# EAGLE design main (EAGLE 6.1)
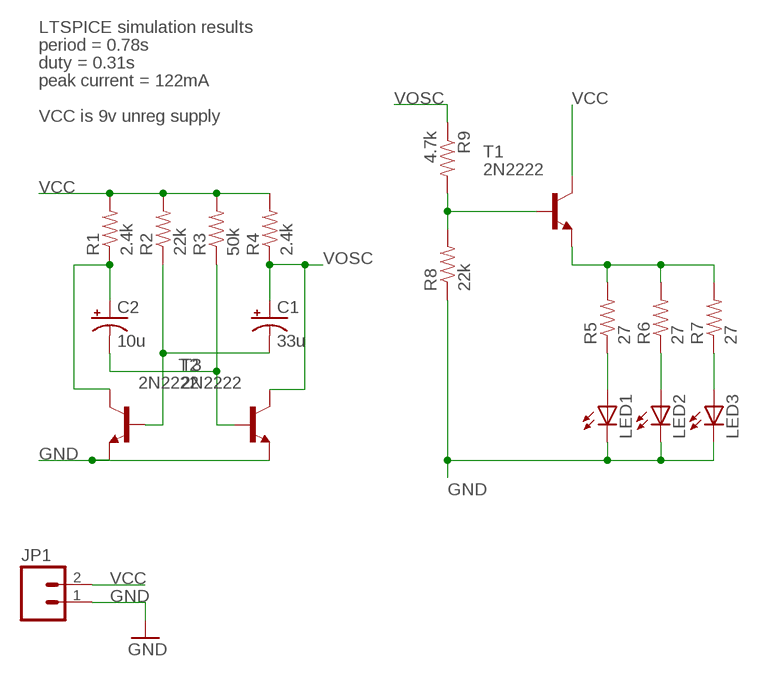
[diagram p0: schematic, sheet 1]

## Parts
C1  33u  CAP_POLPTH1  [CPOL-RADIAL-100UF-25V]
C2  10u  CAP_POLPTH1  [CPOL-RADIAL-100UF-25V]
JP1  M02LOCK  [1X02_LOCK]
LED1  LED5MM  [LED5MM]
LED2  LED5MM  [LED5MM]
LED3  LED5MM  [LED5MM]
R1  2.4k  RESISTORPTH-1/4W  [AXIAL-0.4]
R2  22k  RESISTORPTH-1/4W  [AXIAL-0.4]
R3  50k  RESISTORPTH-1/4W  [AXIAL-0.4]
R4  2.4k  RESISTORPTH-1/4W  [AXIAL-0.4]
R5  27  RESISTORPTH-1/4W  [AXIAL-0.4]
R6  27  RESISTORPTH-1/4W  [AXIAL-0.4]
R7  27  RESISTORPTH-1/4W  [AXIAL-0.4]
R8  22k  RESISTORPTH-1/4W  [AXIAL-0.4]
R9  4.7k  RESISTORPTH-1/4W  [AXIAL-0.4]
T1  2N2222  [TO18]
T2  2N2222  [TO18]
T3  2N2222  [TO18]

## Nets
GND: JP1.1 LED1.K(C) LED2.K(C) LED3.K(C) R8.P$1 T2.1(E) T3.1(E)
N$1: R5.P$2 R6.P$2 R7.P$2 T1.1(E)
N$2: C1.2(-) R2.P$1 T2.2(B)
N$3: C2.2(-) R3.P$1 T3.2(B)
N$4: C2.1(+) R1.P$1 T2.3(C)
N$5: LED1.A R5.P$1
N$6: LED2.A R6.P$1
N$7: LED3.A R7.P$1
N$42: R8.P$2 R9.P$2 T1.2(B)
VCC: JP1.2 R1.P$2 R2.P$2 R3.P$2 R4.P$2 T1.3(C)
VOSC: C1.1(+) R4.P$1 R9.P$1 T3.3(C)

## Notes on the sheet
- LTSPICE simulation results
- period = 0.78s
- duty = 0.31s
- peak current = 122mA
- VCC is 9v unreg supply

## Library data of the parts
C1 C2 = SparkFun:CAP_POL: Capacitor Polarized These are standard SMD and PTH capacitors. Normally 10uF, 47uF, and 100uF in electrolytic and tantalum varieties. Always verify the external diameter of the through hole cap, it varies with capacity, voltage, and manufacturer. The EIA devices should be standard.
JP1 = SparkFun:M02: Header 2 Standard 2-pin 0.1" header. Use with straight break away headers (SKU : PRT-00116), right angle break away headers (PRT-00553), swiss pins (PRT-00743), machine pins (PRT-00117), and female headers (PRT-00115). Molex polarized connector foot print use with SKU : PRT-08233 with associated crimp pins and housings.
LED1-LED3 = SparkFun:LED: LEDs Standard schematic elements and footprints for 5mm, 3mm, 1206, and 0603 sized LEDs. 5mm - Spark Fun Electronics SKU : COM-00529 (and others)
R1-R9 = SparkFun:RESISTOR: Resistor Basic schematic elements and footprints for 0603, 1206, and PTH resistors.
T1-T3 = transistor:2N2222: NPN TRANSISTOR

## Board
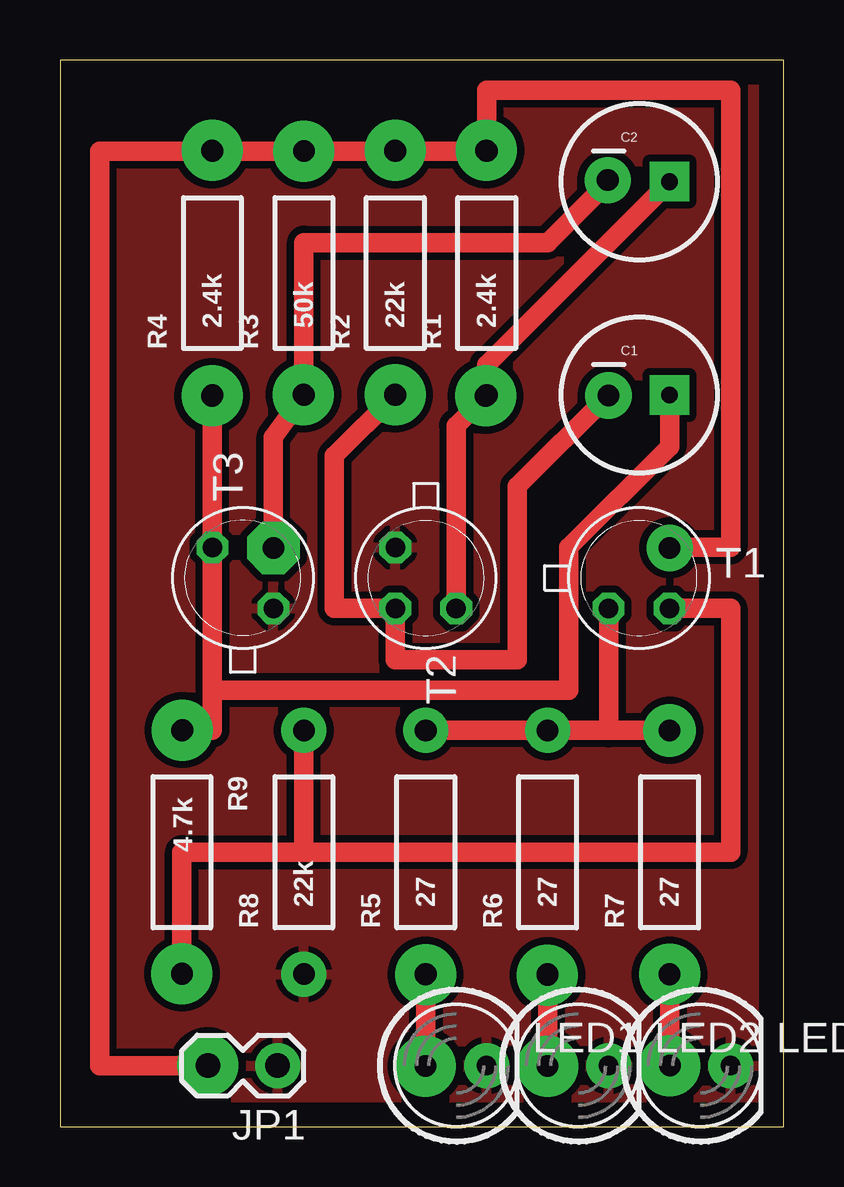
[diagram p1: board, top side]

Size 30.15 x 44.44 mm. Coordinates in mm from the lower left corner, seen from the top.
Outline: 0,0 30.15,0 30.15,44.44 0,44.44 0,0
Copper layers (1*16): Top 0.035mm / dielectric 1.5mm / Bottom 0.035mm
Design rules: minimum track width 10mil, minimum drill 24mil, track to track 8mil, track to pad 8mil, pad to pad 8mil, via to via 8mil, smd to smd 8mil, copper to edge 40mil, drill to drill 8mil, minimum pad ring 10mil, minimum via ring 8mil, stop-mask expansion 4mil, vias tented up to drill 0mil, thermal gap 10mil

### Footprints (pad centres in the part's own frame; a part is rotated, then mirrored left to right if it is on the bottom)
CPOL-RADIAL-100UF-25V = drill 0.7 pad 1.651 square: 1 1.27,0 | drill 0.7 pad 1.651: 2 -1.27,0
1X02_LOCK = drill 1.016 pad 1.88: 1 -0.178,0; 2 2.718,0
LED5MM = drill 0.813 pad 1.88: A -1.27,0; K 1.27,0
AXIAL-0.4 = drill 0.9 pad 1.88: P$1 -5.08,0; P$2 5.08,0
TO18 = drill 0.813 octagon: 1 -1.27,-1.27; 2 1.27,-1.27; 3 1.27,1.27

### Placement (x,y rotation side)
C1  24.13,30.48 0 top
C2  24.13,39.37 0 top
JP1  8.89,2.54 180 top
LED1  16.51,2.54 0 top
LED2  21.59,2.54 0 top
LED3  26.67,2.54 0 top
R1  17.78,35.56 90 top
R2  13.97,35.56 90 top
R3  10.16,35.56 90 top
R4  6.35,35.56 90 top
R5  15.24,11.43 90 top
R6  20.32,11.43 90 top
R7  25.4,11.43 90 top
R8  10.16,11.43 90 top
R9  5.08,11.43 270 top
T1  24.13,22.86 0 top
T2  15.24,22.86 270 top
T3  7.62,22.86 90 top

### Tracks (layer width: path | path; a pad name or v marks a point on that pad's centre or on a via)
GND
  pour Top (isolate 0.305): 0,44.45 30.48,44.45 30.48,0 0,0
N$1
  Top 0.813: R7.P$2 22.86,16.51 | 22.86,16.51 R6.P$2 R5.P$2 | T1.1 22.86,16.51
N$2
  Top 0.813: C1.2 19.05,26.67 19.05,19.45 13.97,19.45 T2.2 11.43,21.59 11.43,27.94 R2.P$1
N$3
  Top 0.813: T3.2 8.89,28.73 R3.P$1 10.16,36.83 20.32,36.83 C2.2
N$4
  Top 0.813: C2.1 17.78,31.75 R1.P$1 16.51,29.21 T2.3
N$5
  Top 0.813: R5.P$1 LED1.A
N$6
  Top 0.813: R6.P$1 LED2.A
N$7
  Top 0.813: R7.P$1 LED3.A
N$8  (via drill 0.9 pad 2.54)
  other vias: 6.34,40.67
N$9  (via drill 0.9 pad 2.54)
  other vias: 10.17,40.64
N$10  (via drill 0.9 pad 2.54)
  other vias: 13.96,40.67
N$11  (via drill 0.9 pad 2.54)
  other vias: 17.76,40.67
N$12  (via drill 0.9 pad 2.54)
  other vias: 6.34,30.44
N$13  (via drill 0.9 pad 2.54)
  other vias: 10.14,30.5
N$14  (via drill 0.9 pad 2.54)
  other vias: 13.96,30.5
N$15  (via drill 0.9 pad 2.54)
  other vias: 17.73,30.44
N$16  (via drill 0.9 pad 2.54)
  other vias: 5.1,16.52
N$17  (via drill 0.9 pad 2.54)
  other vias: 5.08,6.38
N$18  (via drill 0.9 pad 2.18)
  other vias: 8.89,24.11
N$19  (via drill 0.9 pad 2.54)
  other vias: 15.23,6.33
N$20  (via drill 0.9 pad 2.54)
  other vias: 6.16,2.56
N$22  (via drill 0.9 pad 2.54)
  other vias: 15.23,2.52
N$23  (via drill 0.9 pad 2.54)
  other vias: 20.31,2.52
N$24  (via drill 0.9 pad 2.54)
  other vias: 25.41,2.54
N$25  (via drill 0.9 pad 2.54)
  other vias: 25.4,6.34
N$26  (via drill 0.9 pad 2.54)
  other vias: 20.31,6.31
N$35  (via drill 0.9 pad 1.93)
  other vias: 25.4,24.11
N$36  (via drill 0.9 pad 1.93)
  other vias: 22.85,30.46
N$37  (via drill 0.9 pad 1.93)
  other vias: 22.82,39.43
N$38  (via drill 0.9 pad 2.18)
  other vias: 25.4,16.51
N$42
  Top 0.813: R9.P$2 5.08,11.43 10.16,11.43 | 10.16,11.43 R8.P$2 | T1.2 27.94,21.59 27.94,11.43 10.16,11.43
VCC
  Top 0.813: JP1.2 1.67,2.54 1.67,40.64 R4.P$2 R3.P$2 R2.P$2 R1.P$2 17.78,43.18 27.94,43.18 27.94,24.13 T1.3
VOSC
  Top 0.813: 6.35,18.18 T3.3 R4.P$1 | 6.35,18.18 6.35,16.51 R9.P$1 | C1.1 25.4,28.34 21.2,24.13 21.2,18.18 6.35,18.18